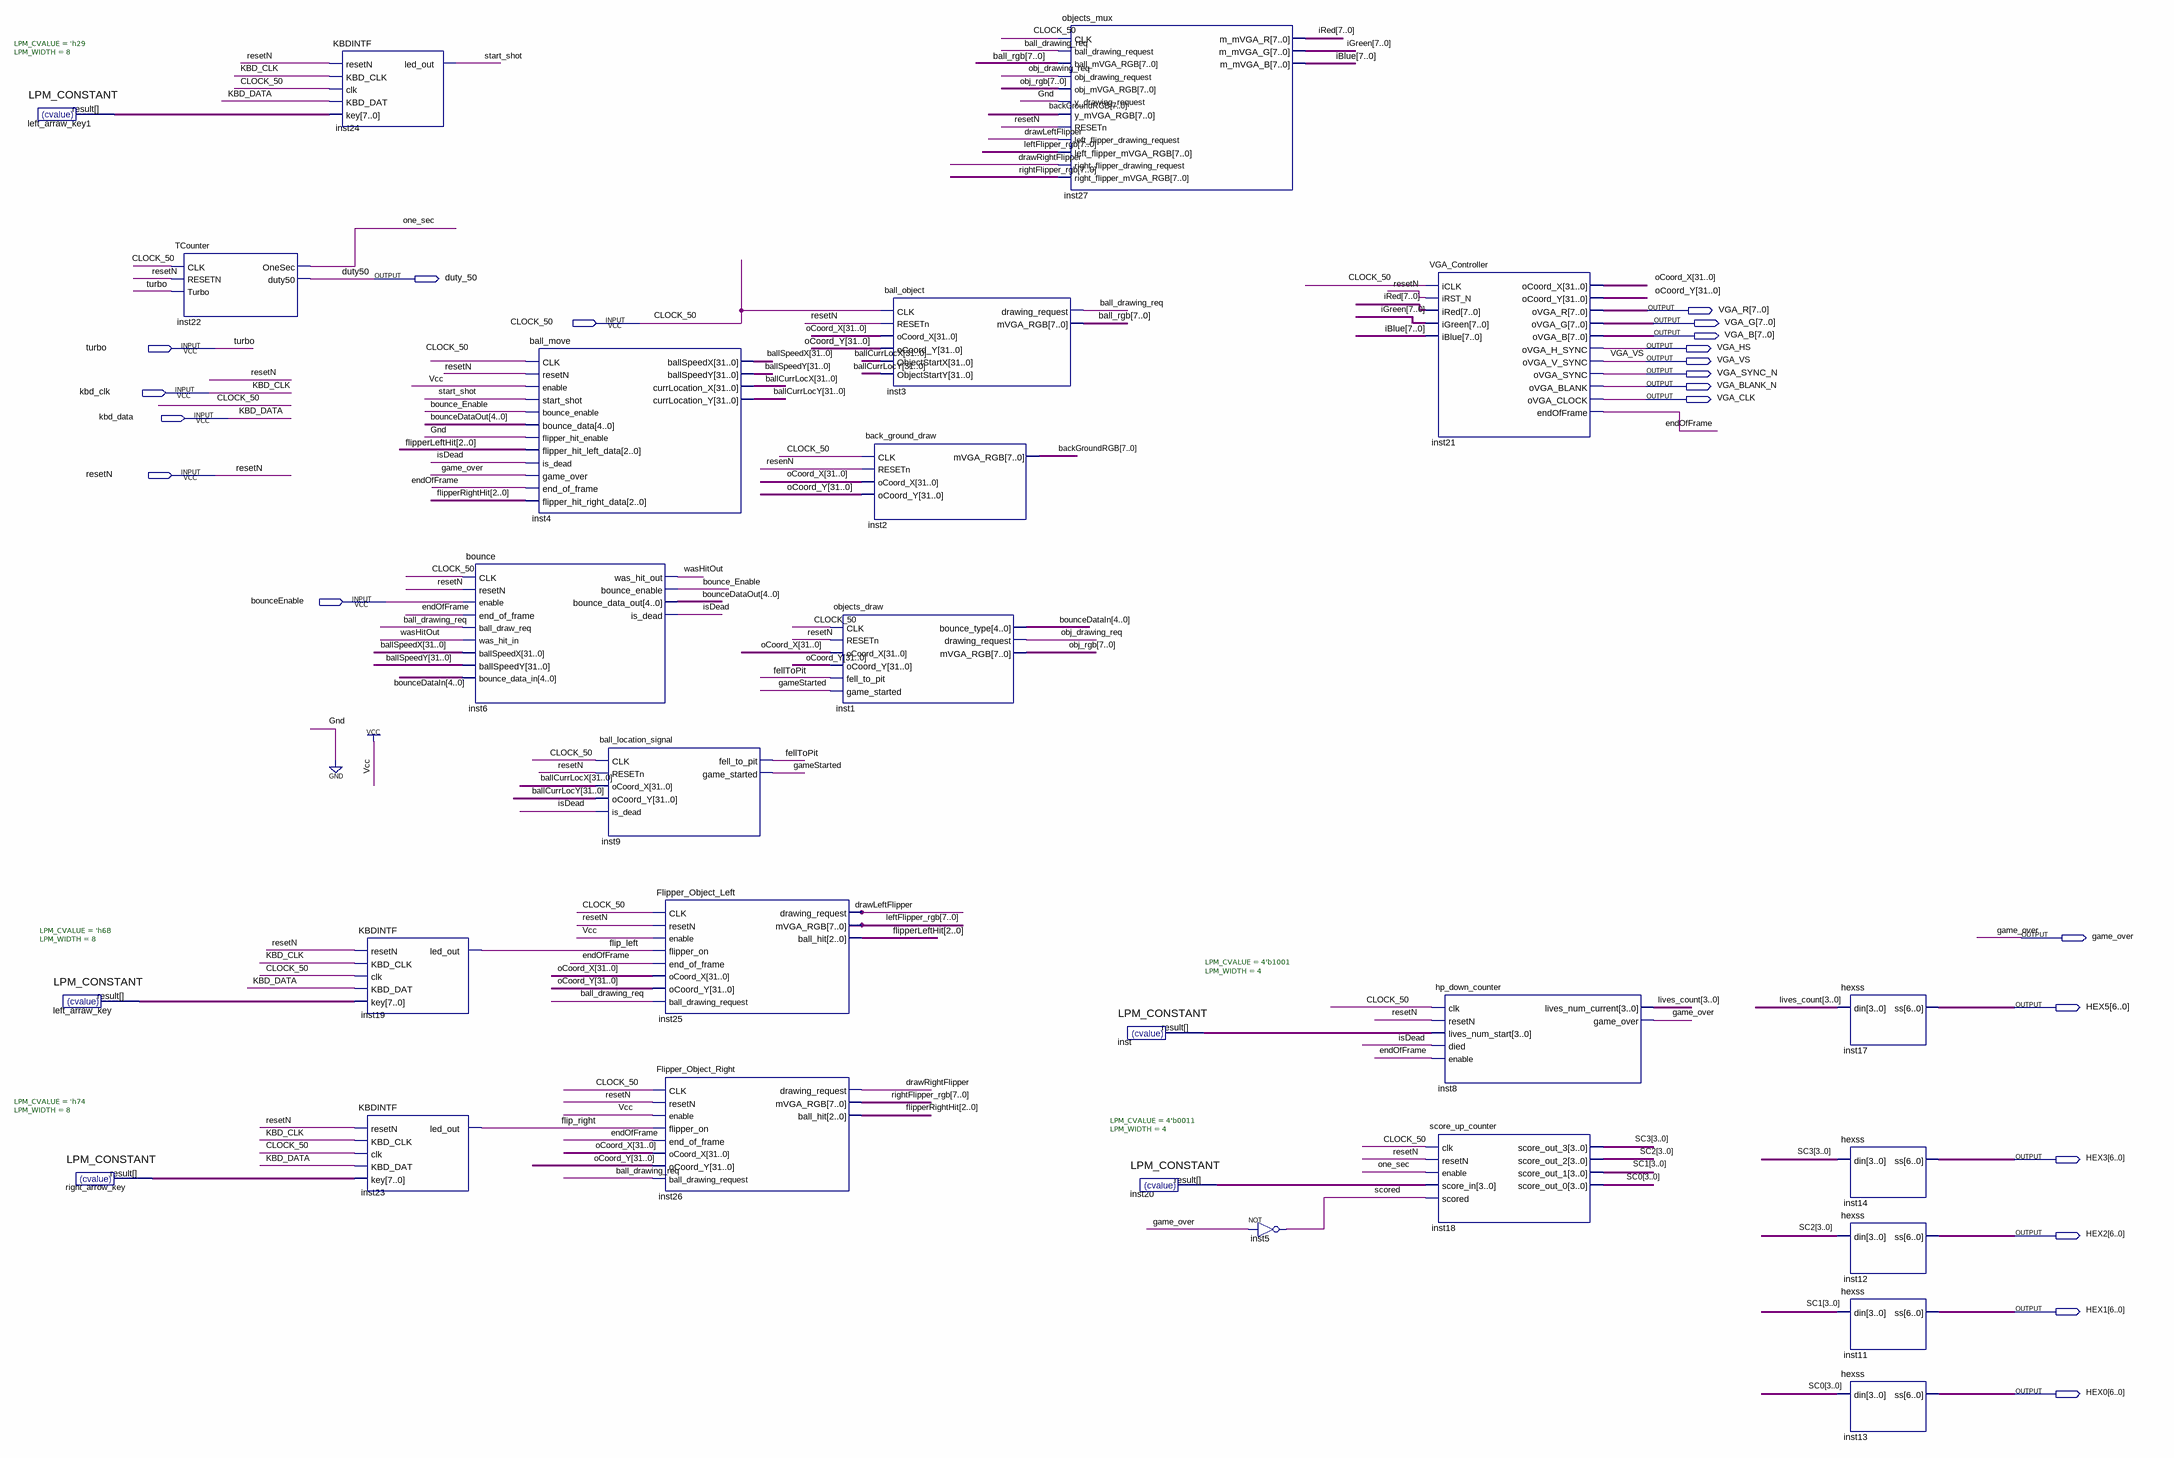
[diagram p0: schematic sheet]
// Quartus schematic PIN_BALL_GAMEPLAY.bdf as structural Verilog: 27 symbols, 21 pins
module PIN_BALL_GAMEPLAY (
  input  CLOCK_50,
  input  turbo,
  input  kbd_clk,
  input  kbd_data,
  input  resetN,
  input  bounceEnable,
  output duty_50,
  output [7:0] VGA_R,
  output [7:0] VGA_G,
  output [7:0] VGA_B,
  output VGA_HS,
  output VGA_VS,
  output VGA_SYNC_N,
  output VGA_BLANK_N,
  output VGA_CLK,
  output game_over,
  output [6:0] HEX5,
  output [6:0] HEX3,
  output [6:0] HEX2,
  output [6:0] HEX1,
  output [6:0] HEX0
);

  wire ball_drawing_req, bounce_Enable, drawLeftFlipper, drawRightFlipper, endOfFrame, fellToPit, flip_left,
       flip_right, gameStarted, isDead, obj_drawing_req, one_sec, resenN, scored, start_shot, wasHitOut;
  wire [2:0] flipperLeftHit, flipperRightHit;
  wire [3:0] inst20_result, inst_result, lives_count, SC0, SC1, SC2, SC3;
  wire [4:0] bounceDataIn, bounceDataOut;
  wire [7:0] backGroundRGB, ball_rgb, iBlue, iGreen, iRed, left_arraw_key1_result, left_arraw_key_result,
       leftFlipper_rgb, obj_rgb, right_arrow_key_result, rightFlipper_rgb;
  wire [31:0] ballCurrLocX, ballCurrLocY, ballSpeedX, ballSpeedY, oCoord_X, oCoord_Y;

  LPM_CONSTANT #(.LPM_CVALUE('h29), .LPM_WIDTH(8)) left_arraw_key1 (.result(left_arraw_key1_result));
  LPM_CONSTANT #(.LPM_CVALUE('h6B), .LPM_WIDTH(8)) left_arraw_key (.result(left_arraw_key_result));
  LPM_CONSTANT #(.LPM_CVALUE('h74), .LPM_WIDTH(8)) right_arrow_key (.result(right_arrow_key_result));
  TCounter inst22 (.CLK(CLOCK_50), .RESETN(resetN), .Turbo(turbo), .OneSec(one_sec), .duty50(duty_50));
  KBDINTF inst24 (
    .resetN(resetN), .KBD_CLK(kbd_clk), .clk(CLOCK_50), .KBD_DAT(kbd_data), .key(left_arraw_key1_result),
    .led_out(start_shot));
  KBDINTF inst19 (
    .resetN(resetN), .KBD_CLK(kbd_clk), .clk(CLOCK_50), .KBD_DAT(kbd_data), .key(left_arraw_key_result),
    .led_out(flip_left));
  KBDINTF inst23 (
    .resetN(resetN), .KBD_CLK(kbd_clk), .clk(CLOCK_50), .KBD_DAT(kbd_data), .key(right_arrow_key_result),
    .led_out(flip_right));
  bounce inst6 (
    .CLK(CLOCK_50), .resetN(resetN), .enable(bounceEnable), .end_of_frame(endOfFrame),
    .ball_draw_req(ball_drawing_req), .was_hit_in(wasHitOut), .ballSpeedX(ballSpeedX),
    .ballSpeedY(ballSpeedY), .bounce_data_in(bounceDataIn), .was_hit_out(wasHitOut),
    .bounce_enable(bounce_Enable), .bounce_data_out(bounceDataOut), .is_dead(isDead));
  ball_move inst4 (
    .CLK(CLOCK_50), .resetN(resetN), .enable(1'b1), .start_shot(start_shot), .bounce_enable(bounce_Enable),
    .bounce_data(bounceDataOut), .flipper_hit_enable(1'b0), .flipper_hit_left_data(flipperLeftHit),
    .is_dead(isDead), .game_over(game_over), .end_of_frame(endOfFrame),
    .flipper_hit_right_data(flipperRightHit), .ballSpeedX(ballSpeedX), .ballSpeedY(ballSpeedY),
    .currLocation_X(ballCurrLocX), .currLocation_Y(ballCurrLocY));
  ball_location_signal inst9 (
    .CLK(CLOCK_50), .RESETn(resetN), .oCoord_X(ballCurrLocX), .oCoord_Y(ballCurrLocY), .is_dead(isDead),
    .fell_to_pit(fellToPit), .game_started(gameStarted));
  Flipper_Object_Left inst25 (
    .CLK(CLOCK_50), .resetN(resetN), .enable(1'b1), .flipper_on(flip_left), .end_of_frame(endOfFrame),
    .oCoord_X(oCoord_X), .oCoord_Y(oCoord_Y), .ball_drawing_request(ball_drawing_req),
    .drawing_request(drawLeftFlipper), .mVGA_RGB(leftFlipper_rgb), .ball_hit(flipperLeftHit));
  Flipper_Object_Right inst26 (
    .CLK(CLOCK_50), .resetN(resetN), .enable(1'b1), .flipper_on(flip_right), .end_of_frame(endOfFrame),
    .oCoord_X(oCoord_X), .oCoord_Y(oCoord_Y), .ball_drawing_request(ball_drawing_req),
    .drawing_request(drawRightFlipper), .mVGA_RGB(rightFlipper_rgb), .ball_hit(flipperRightHit));
  objects_draw inst1 (
    .CLK(CLOCK_50), .RESETn(resetN), .oCoord_X(oCoord_X), .oCoord_Y(oCoord_Y), .fell_to_pit(fellToPit),
    .game_started(gameStarted), .bounce_type(bounceDataIn), .drawing_request(obj_drawing_req),
    .mVGA_RGB(obj_rgb));
  ball_object inst3 (
    .CLK(CLOCK_50), .RESETn(resetN), .oCoord_X(oCoord_X), .oCoord_Y(oCoord_Y), .ObjectStartX(ballCurrLocX),
    .ObjectStartY(ballCurrLocY), .drawing_request(ball_drawing_req), .mVGA_RGB(ball_rgb));
  back_ground_draw inst2 (
    .CLK(CLOCK_50), .RESETn(resenN), .oCoord_X(oCoord_X), .oCoord_Y(oCoord_Y), .mVGA_RGB(backGroundRGB));
  objects_mux inst27 (
    .CLK(CLOCK_50), .ball_drawing_request(ball_drawing_req), .ball_mVGA_RGB(ball_rgb),
    .obj_drawing_request(obj_drawing_req), .obj_mVGA_RGB(obj_rgb), .y_drawing_request(1'b0),
    .y_mVGA_RGB(backGroundRGB), .RESETn(resetN), .left_flipper_drawing_request(drawLeftFlipper),
    .left_flipper_mVGA_RGB(leftFlipper_rgb), .right_flipper_drawing_request(drawRightFlipper),
    .right_flipper_mVGA_RGB(rightFlipper_rgb), .m_mVGA_R(iRed), .m_mVGA_G(iGreen), .m_mVGA_B(iBlue));
  LPM_CONSTANT #(.LPM_CVALUE(4'b1001), .LPM_WIDTH(4)) inst (.result(inst_result));
  LPM_CONSTANT #(.LPM_CVALUE(4'b0011), .LPM_WIDTH(4)) inst20 (.result(inst20_result));
  not inst5 (scored, game_over);
  VGA_Controller inst21 (
    .iCLK(CLOCK_50), .iRST_N(resetN), .iRed(iRed), .iGreen(iGreen), .iBlue(iBlue), .oCoord_X(oCoord_X),
    .oCoord_Y(oCoord_Y), .oVGA_R(VGA_R), .oVGA_G(VGA_G), .oVGA_B(VGA_B), .oVGA_H_SYNC(VGA_HS),
    .oVGA_V_SYNC(VGA_VS), .oVGA_SYNC(VGA_SYNC_N), .oVGA_BLANK(VGA_BLANK_N), .oVGA_CLOCK(VGA_CLK),
    .endOfFrame(endOfFrame));
  hp_down_counter inst8 (
    .clk(CLOCK_50), .resetN(resetN), .lives_num_start(inst_result), .died(isDead), .enable(endOfFrame),
    .lives_num_current(lives_count), .game_over(game_over));
  score_up_counter inst18 (
    .clk(CLOCK_50), .resetN(resetN), .enable(one_sec), .score_in(inst20_result), .scored(scored),
    .score_out_3(SC3), .score_out_2(SC2), .score_out_1(SC1), .score_out_0(SC0));
  hexss inst17 (.din(lives_count), .ss(HEX5));
  hexss inst14 (.din(SC3), .ss(HEX3));
  hexss inst12 (.din(SC2), .ss(HEX2));
  hexss inst11 (.din(SC1), .ss(HEX1));
  hexss inst13 (.din(SC0), .ss(HEX0));

  // Other names for the same wires on the sheet: duty50 = duty_50
endmodule
